# EAGLE design IgniterDriver (EAGLE 9.5.1)
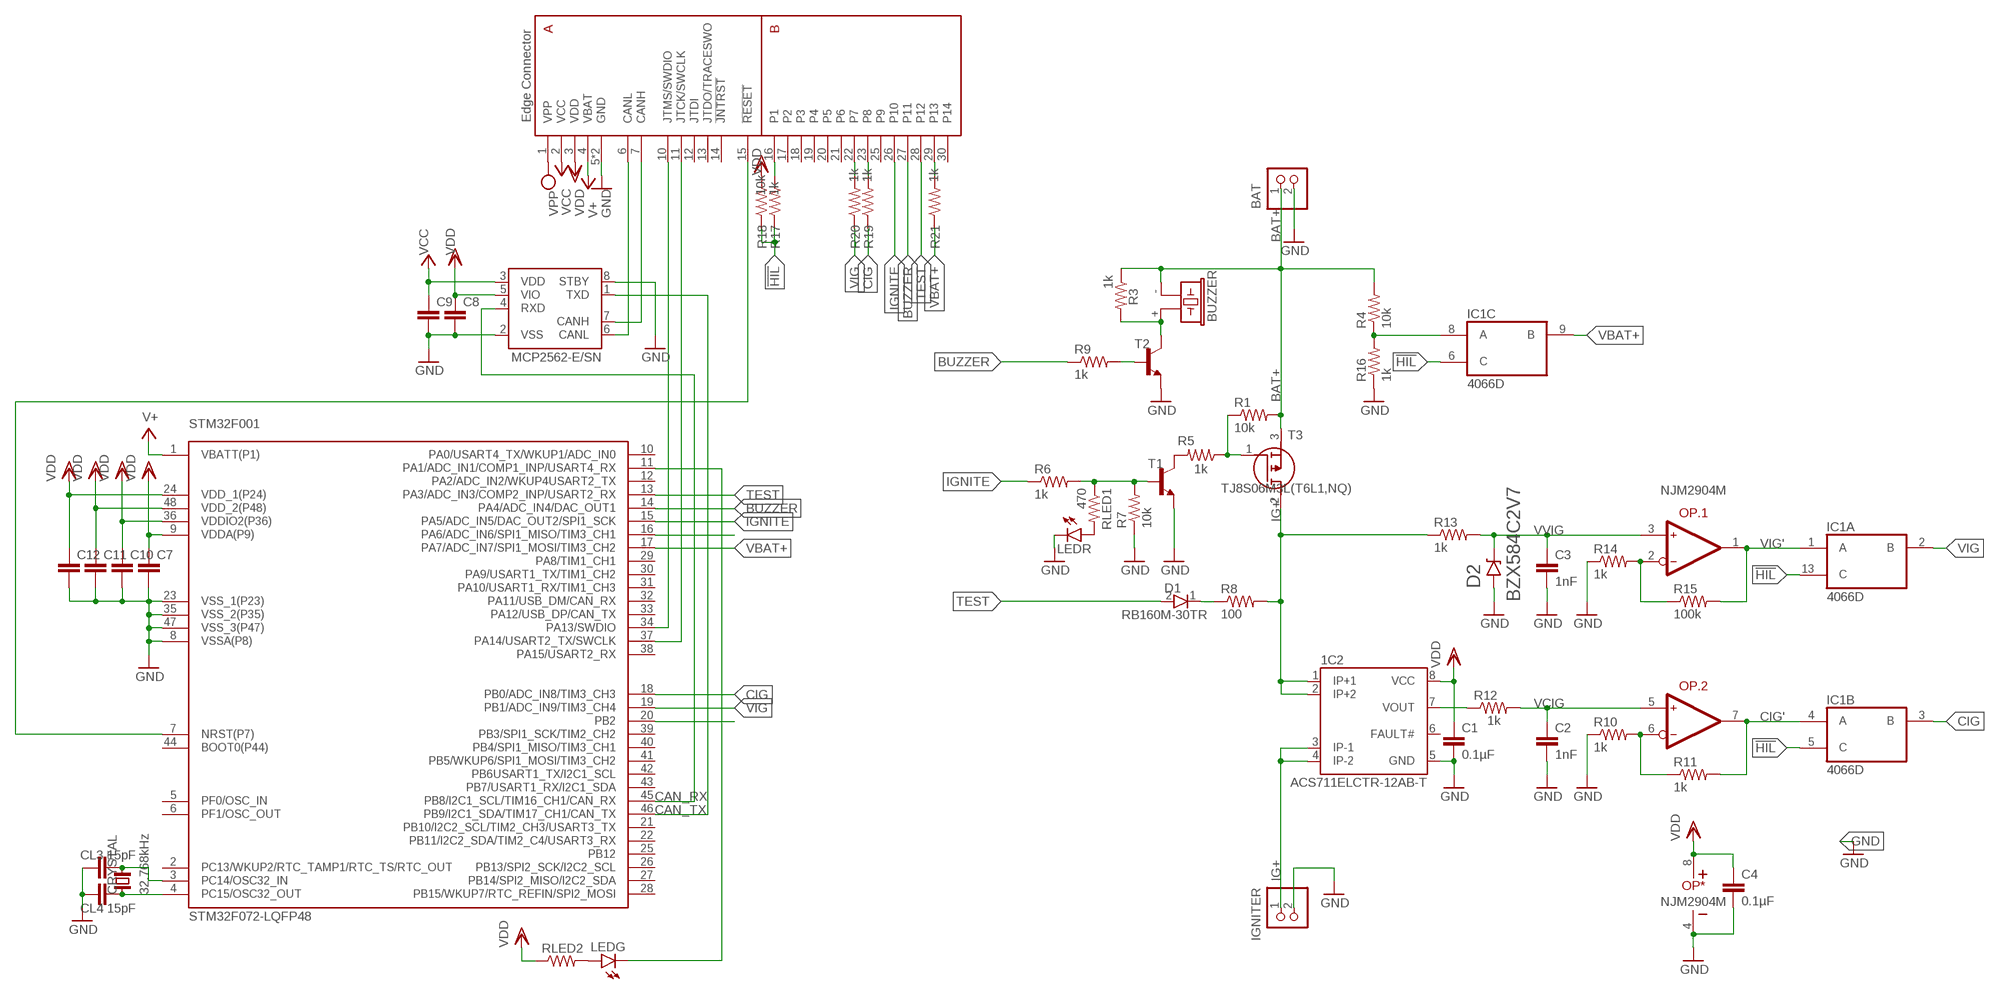
[diagram p0: schematic, sheet 1]

## Parts
1C2  ACS711ELCTR-12AB-T  [SOIC8]
BAT  S2B-XH-A  [S2B-XH-A]
BUZZER  F/CM12P  [F/CM12P]
C1  0.1µF  C-EUC0603K  [C0603K]
C2  1nF  C-EUC0603K  [C0603K]
C3  1nF  C-EUC0603K  [C0603K]
C4  0.1µF  C-EUC0603K  [C0603K]
C7  C-EUC0603K  [C0603K]
C8  C-EUC0603K  [C0603K]
C9  C-EUC0603K  [C0603K]
C10  C-EUC0603K  [C0603K]
C11  C-EUC0603K  [C0603K]
C12  C-EUC0603K  [C0603K]
CL3  15pF  C-EUC0603K  [C0603K]
CL4  15pF  C-EUC0603K  [C0603K]
CRYSTAL  32.768kHz  CRYTALFC-255  [FC-255]
D1  RB160M-30TR  [SODFL3516X90N]
D2  BZX584C2V7  BZX584C  [BZX584C]
IC1  4066D  [SO14]
IGNITER  S2B-XH-A  [S2B-XH-A]
LEDG  LEDCHIP-LED0603  [CHIP-LED0603]
LEDR  LEDCHIPLED_0603  [CHIPLED_0603]
MCP2562  MCP2562-E/SN  [SOIC127P600X175-8N]
OP  NJM2904M  [SO-8]
R1  10k  R-US_R0603  [R0603]
R3  1k  R-US_R0603  [R0603]
R4  10k  R-US_R0603  [R0603]
R5  1k  R-US_R0603  [R0603]
R6  1k  R-US_R0603  [R0603]
R7  10k  R-US_R0603  [R0603]
R8  100  R-US_R0603  [R0603]
R9  1k  R-US_R0603  [R0603]
R10  1k  R-US_R0603  [R0603]
R11  1k  R-US_R0603  [R0603]
R12  1k  R-US_R0603  [R0603]
R13  1k  R-US_R0603  [R0603]
R14  1k  R-US_R0603  [R0603]
R15  100k  R-US_R0603  [R0603]
R16  1k  R-US_R0603  [R0603]
R17  1k  R-US_R0603  [R0603]
R18  10k  R-US_R0603  [R0603]
R19  1k  R-US_R0603  [R0603]
R20  1k  R-US_R0603  [R0603]
R21  1k  R-US_R0603  [R0603]
RLED1  470  R-US_R0603  [R0603]
RLED2  R-US_R0603  [R0603]
STM32F001  STM32F072-LQFP48  [LQFP48]
T1  -NPN-SOT23-EBC  [SOT23-EBC]
T2  -NPN-SOT23-EBC  [SOT23-EBC]
T3  TJ8S06M3L(T6L1,NQ)  [TJ8S06M3LT6L1NQ]
U$2  EDGE30  [EDGE30]

## Nets
!HIL!: IC1.5(B:C) IC1.6(C:C) IC1.13(A:C) R17.1 R18.1
BAT+: BAT.1 BUZZER.- R1.2 R3.1 R4.2 T3.3(S)
BUZZER: R9.1 STM32F001.14(PA4/ADC_IN4/DAC_OUT1) U$2.27(P11)
CAN_RX: MCP2562.4(RXD) STM32F001.45(PB8/I2C1_SCL/TIM16_CH1/CAN_RX)
CAN_TX: MCP2562.1(TXD) STM32F001.46(PB9/I2C1_SDA/TIM17_CH1/CAN_TX)
CANH1: MCP2562.7(CANH) U$2.7(CANH)
CANL1: MCP2562.6(CANL) U$2.6(CANL)
CIG: IC1.3(B:B) R19.1 STM32F001.18(PB0/ADC_IN8/TIM3_CH3)
CIG': IC1.4(B:A) OP.7(.2:OUT) R11.2
GND: 1C2.5(GND) BAT.2 C1.2 C2.2 C3.2 C4.2 C7.2 C8.2 C9.2 C10.2 C11.2 C12.2 CL3.1 CL4.1 D2.A IGNITER.2 LEDR.C MCP2562.2(VSS) MCP2562.8(STBY) OP.4(*:V-) R7.1 R10.1 R14.1 R16.1 STM32F001.8(VSSA(P8)) STM32F001.23(VSS_1(P23)) STM32F001.35(VSS_2(P35)) STM32F001.47(VSS_3(P47)) T1.E T2.E U$2.5(GND) U$2.8(GND)
IG+: 1C2.3(IP-1) 1C2.4(IP-2) IGNITER.1
IG+': 1C2.1(IP+1) 1C2.2(IP+2) R8.2 R13.1 T3.2(D)
IGNITE: R6.1 STM32F001.15(PA5/ADC_IN5/DAC_OUT2/SPI1_SCK) U$2.26(P10)
N$1: R1.1 R5.1 T3.1(G)
N$2: R5.2 T1.C
N$6: R6.2 R7.2 RLED1.1 T1.B
N$7: D1.1(K) R8.1
N$8: BUZZER.+ R3.2 T2.C
N$11: OP.2(.1:IN-) R14.2 R15.1
N$12: OP.6(.2:IN-) R10.2 R11.1
N$13: LEDR.A RLED1.2
N$15: R9.2 T2.B
N$47: R21.2 U$2.29(P13)
N$52: R19.2 U$2.23(P8)
N$53: R20.2 U$2.22(P7)
N$64: STM32F001.16(PA6/ADC_IN6/SPI1_MISO/TIM3_CH1)
N$71: STM32F001.20(PB2)
N$78: CL4.2 CRYSTAL.1 STM32F001.4(PC15/OSC32_OUT)
N$79: CL3.2 CRYSTAL.2 STM32F001.3(PC14/OSC32_IN)
N$80: LEDG.C STM32F001.11(PA1/ADC_IN1/COMP1_INP/USART4_RX)
N$81: R17.2 U$2.16(P1)
N$83: LEDG.A RLED2.2
NRST1: STM32F001.7(NRST(P7)) U$2.15(!RESET!)
SWCLK1: STM32F001.37(PA14/USART2_TX/SWCLK) U$2.11(JTCK/SWCLK)
SWDIO1: STM32F001.34(PA13/SWDIO) U$2.10(JTMS/SWDIO)
TEST: D1.2(A) STM32F001.13(PA3/ADC_IN3/COMP2_INP/USART2_RX) U$2.28(P12)
VBAT+: IC1.9(C:B) R21.1 STM32F001.17(PA7/ADC_IN7/SPI1_MOSI/TIM3_CH2)
VBAT+': IC1.8(C:A) R4.1 R16.2
VBU: STM32F001.1(VBATT(P1)) U$2.4(VBAT) ; supply symbol labelled V+
VCC: C9.1 MCP2562.3(VDD) U$2.2(VCC)
VCIG: C2.1 OP.5(.2:IN+) R12.2
VDD: 1C2.8(VCC) C1.1 C4.1 C7.1 C8.1 C10.1 C11.1 C12.1 MCP2562.5(VIO) OP.8(*:V+) R18.2 RLED2.1 STM32F001.9(VDDA(P9)) STM32F001.24(VDD_1(P24)) STM32F001.36(VDDIO2(P36)) STM32F001.48(VDD_2(P48)) U$2.3(VDD)
VIG: IC1.2(A:B) R20.1 STM32F001.19(PB1/ADC_IN9/TIM3_CH4)
VIG': IC1.1(A:A) OP.1(.1:OUT) R15.2
VOUT: 1C2.7(VOUT) R12.1
VPP: U$2.1(VPP)
VVIG: C3.1 D2.C OP.3(.1:IN+) R13.2
Unconnected: 1C2.6(FAULT#) IC1.10(D:B) IC1.11(D:A) IC1.12(D:C) STM32F001.2(PC13/WKUP2/RTC_TAMP1/RTC_TS/RTC_OUT) STM32F001.5(PF0/OSC_IN) STM32F001.6(PF1/OSC_OUT) STM32F001.10(PA0/USART4_TX/WKUP1/ADC_IN0) STM32F001.12(PA2/ADC_IN2/WKUP4USART2_TX) STM32F001.21(PB10/I2C2_SCL/TIM2_CH3/USART3_TX) STM32F001.22(PB11/I2C2_SDA/TIM2_C4/USART3_RX) STM32F001.25(PB12) STM32F001.26(PB13/SPI2_SCK/I2C2_SCL) STM32F001.27(PB14/SPI2_MISO/I2C2_SDA) STM32F001.28(PB15/WKUP7/RTC_REFIN/SPI2_MOSI) STM32F001.29(PA8/TIM1_CH1) STM32F001.30(PA9/USART1_TX/TIM1_CH2) STM32F001.31(PA10/USART1_RX/TIM1_CH3) STM32F001.32(PA11/USB_DM/CAN_RX) STM32F001.33(PA12/USB_DP/CAN_TX) STM32F001.38(PA15/USART2_RX) STM32F001.39(PB3/SPI1_SCK/TIM2_CH2) STM32F001.40(PB4/SPI1_MISO/TIM3_CH1) STM32F001.41(PB5/WKUP6/SPI1_MOSI/TIM3_CH2) STM32F001.42(PB6USART1_TX/I2C1_SCL) STM32F001.43(PB7/USART1_RX/I2C1_SDA) STM32F001.44(BOOT0(P44)) U$2.12(JTDI) U$2.13(JTDO/TRACESWO) U$2.14(!JNTRST!) U$2.17(P2) U$2.18(P3) U$2.19(P4) U$2.20(P5) U$2.21(P6) U$2.25(P9) U$2.30(P14)

## Power pins joined to a net without a drawn wire
GND: IC1.7(P:VSS)
VDD: IC1.14(P:VDD)

## Library data of the parts
1C2 = allegro:ACS711E: SENSOR CURRENT 3.3V 8-SOIC tested: YES (etherbotix); CURRENT: 12.5A
BAT IGNITER = con-jst-xh:S2B-XH-A: Wire-to-Board 2.5mm pitch side mount connector Source: http://www.jst-mfg.com/product/pdf/jpn/XH.pdf http://www.jst-mfg.com/product/detail.php?series=277
BUZZER = buzzer:F/CM12P: BUZZER Source: Buerklin; OC_FARNELL: unknown; OC_NEWARK: unknown
C1-C4 C7-C12 CL3 CL4 = rcl:C-EU: CAPACITOR, European symbol; SPICEPREFIX: C
CRYSTAL = crystal':CRYTAL: CRYSTAL
D1 = RB160M-30TR:RB160M-30TR: ROHM - RB160M-30TR - DIODE, SCHOTTKY, PMDS Source: Datasheet <https://componentsearchengine.com/Datasheets/2/RB160M-30TR.pdf>; DESCRIPTION: ROHM - RB160M-30TR - DIODE, SCHOTTKY, PMDS; HEIGHT: 0.9mm; MANUFACTURER_NAME: ROHM Semiconductor; MANUFACTURER_PART_NUMBER: RB160M-30TR; MOUSER_PART_NUMBER: 755-RB160M-30TR; MOUSER_PRICE-STOCK: https://www.mouser.com/Search/Refine.aspx?Keyword=755-RB160M-30TR; RS_PART_NUMBER: 7526079; RS_PRICE-STOCK: https://uk.rs-online.com/web/p/products/7526079
D2 = diodes:BZX584C
IC1 = 40xx:4066: Quad bilateral ANALOG SWITCH
LEDG LEDR = led:LED: LED OSRAM: - CHIPLED LG R971, LG N971, LY N971, LG Q971, LY Q971, LO R971, LY R971 LH N974, LH R974 LS Q976, LO Q976, LY Q976 LO Q996 - Hyper CHIPLED LW Q18S LB Q993, LB Q99A, LB R99A - SideLED LS A670, LO A670, LY A670, LG A670, LP A670 LB A673, LV A673, LT A673, LW A673 LH A674 LY A675 LS A676, LA A676, LO A676, LY A676, LW A676 LS A679, LY A679, LG A679 - Hyper Micro SIDELED® LS Y876, LA Y876, LO Y876, LY Y876 LT Y87S - SmartLED LW L88C, LW L88S LB L89C, LB L89S, LG L890 LS L89K, LO L89K, LY L89K LS L896, LA L896, LO L896, LY L896 - TOPLED LS T670, LO T670, LY T670, LG T670, LP T670 LSG T670, LSP T670, LSY T670, LOP T670, LYG T670 LG T671, LOG T671, LSG T671 LB T673, LV T673, LT T673, LW T673 LH T674 LS T676, LA T676, LO T676, LY T676, LB T676, LH T676, LSB T676, LW T676 LB T67C, LV T67C, LT T67C, LS T67K, LO T67K, LY T67K, LW E67C LS E67B, LA E67B, LO E67B, LY E67B, LB E67C, LV E67C, LT E67C LW T67C LS T679, LY T679, LG T679 LS T770, LO T770, LY T770, LG T770, LP T770 LB T773, LV T773, LT T773, LW T773 LH T774 LS E675, LA E675, LY E675, LS T675 LS T776, LA T776, LO T776, LY T776, LB T776 LHGB T686 LT T68C, LB T68C - Hyper Mini TOPLED® LB M676 - Mini TOPLED Santana® LG M470 LS M47K, LO M47K, LY M47K Source: http://www.osram.convergy.de LUXEON: - LUMILED® LXK2-PW12-R00, LXK2-PW12-S00, LXK2-PW14-U00, LXK2-PW14-V00 LXK2-PM12-R00, LXK2-PM12-S00, LXK2-PM14-U00 LXK2-PE12-Q00, LXK2-PE12-R00, LXK2-PE12-S00, LXK2-PE14-T00, LXK2-PE14-U00 LXK2-PB12-K00, LXK2-PB12-L00, LXK2-PB12-M00, LXK2-PB14-N00, LXK2-PB14-P00, LXK2-PB14-Q00 LXK2-PR12-L00, LXK2-PR12-M00, LXK2-PR14-Q00, LXK2-PR14-R00 LXK2-PD12-Q00, LXK2-PD12-R00, LXK2-PD12-S00 LXK2-PH12-R00, LXK2-PH12-S00 LXK2-PL12-P00, LXK2-PL12-Q00, LXK2-PL12-R00 Source: www.luxeon.com KINGBRIGHT: KA-3528ASYC Source: www.kingbright.com
MCP2562 = mcp2562-E_SN:MCP2562-E/SN: MCP2562 Series 5 V Surface Mount High-Speed CAN Transceiver - SOIC-8; AVAILABILITY: Unavailable; DESCRIPTION: Microchip MCP2562-E/SN, CAN Transceiver 1MBps 1-channel IEC 61000-4-2, 8-Pin SOIC; MF: Microchip; MP: MCP2562-E/SN; PACKAGE: SO-8 Microchip; PRICE: None
OP = ic-jrc:NJM2904; MOUSER: 513-NJM2904M
R1 R3-R18 RLED1 RLED2 = rcl:R-US_: RESISTOR, American symbol; SPICEPREFIX: R
R19-R21 = resistor:R-US_: RESISTOR, American symbol
STM32F001 = stm32f0:STM32F072
T1 T2 = transistor:*-NPN-: NPN Transistror BF959 corrected 2008.03.06
T3 = TJ8S06M3L(T6L1_NQ):TJ8S06M3L(T6L1,NQ): MOSFET P-Ch MOS -8A -60V 27W 890pF 0.104 Source: Datasheet <http://toshiba.semicon-storage.com/info/docget.jsp?did=22588&prodName=TJ8S06M3L>; DESCRIPTION: MOSFET P-Ch MOS -8A -60V 27W 890pF 0.104; HEIGHT: 2mm; MANUFACTURER_NAME: Toshiba; MANUFACTURER_PART_NUMBER: TJ8S06M3L(T6L1,NQ); MOUSER_PART_NUMBER: 757-TJ8S06M3LT6L1NQ; MOUSER_PRICE-STOCK: https://www.mouser.com/Search/Refine.aspx?Keyword=757-TJ8S06M3LT6L1NQ
U$2 = bus:EDGE30

## Board
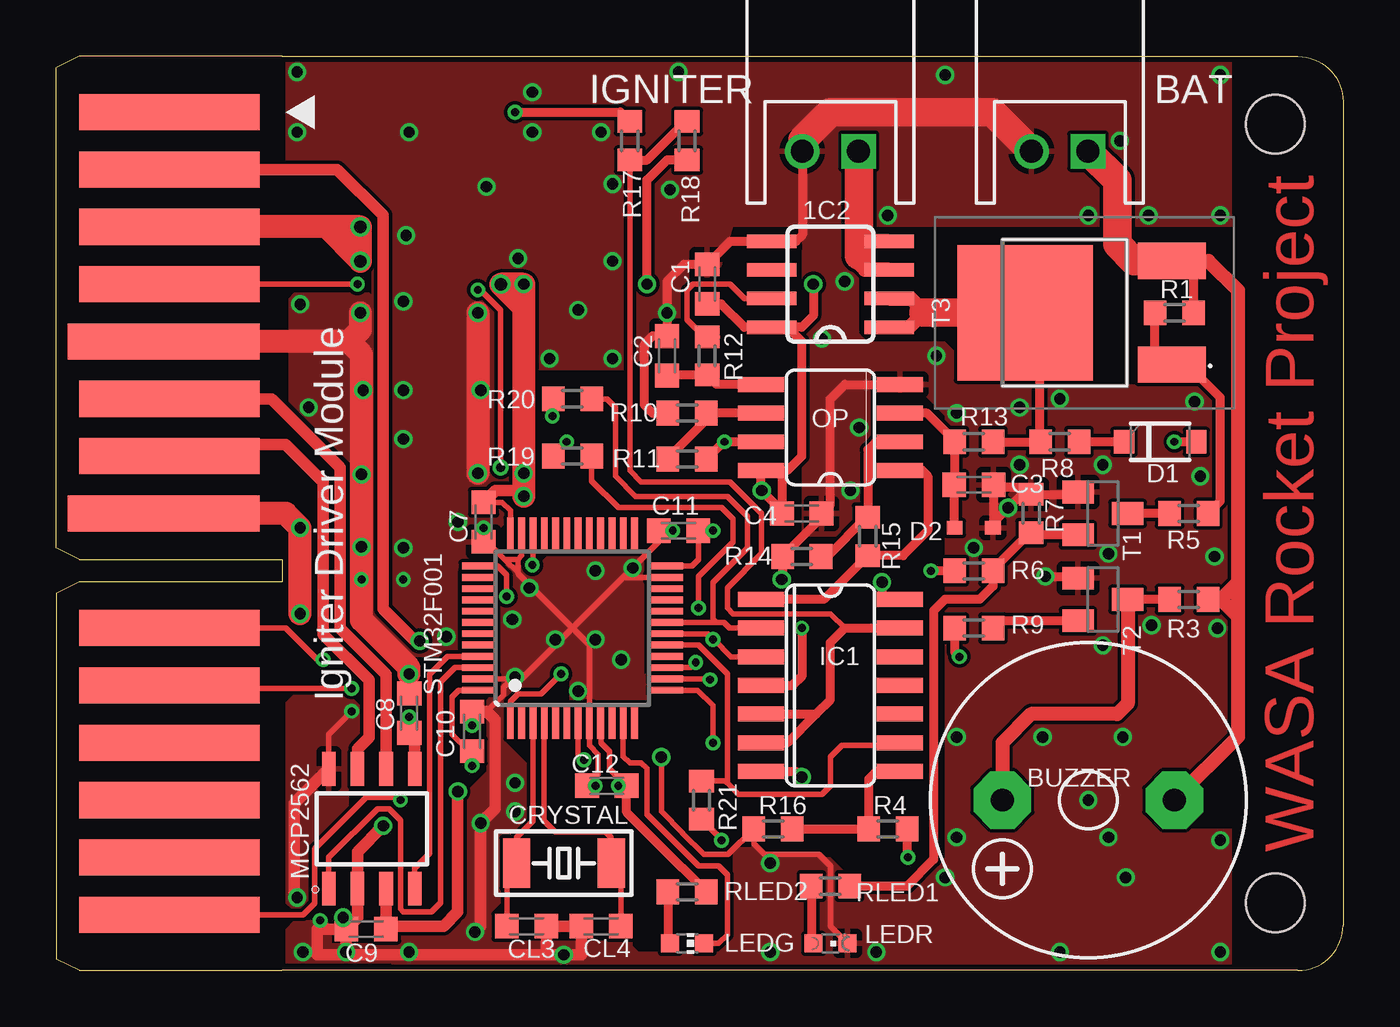
[diagram p1: board, top side]
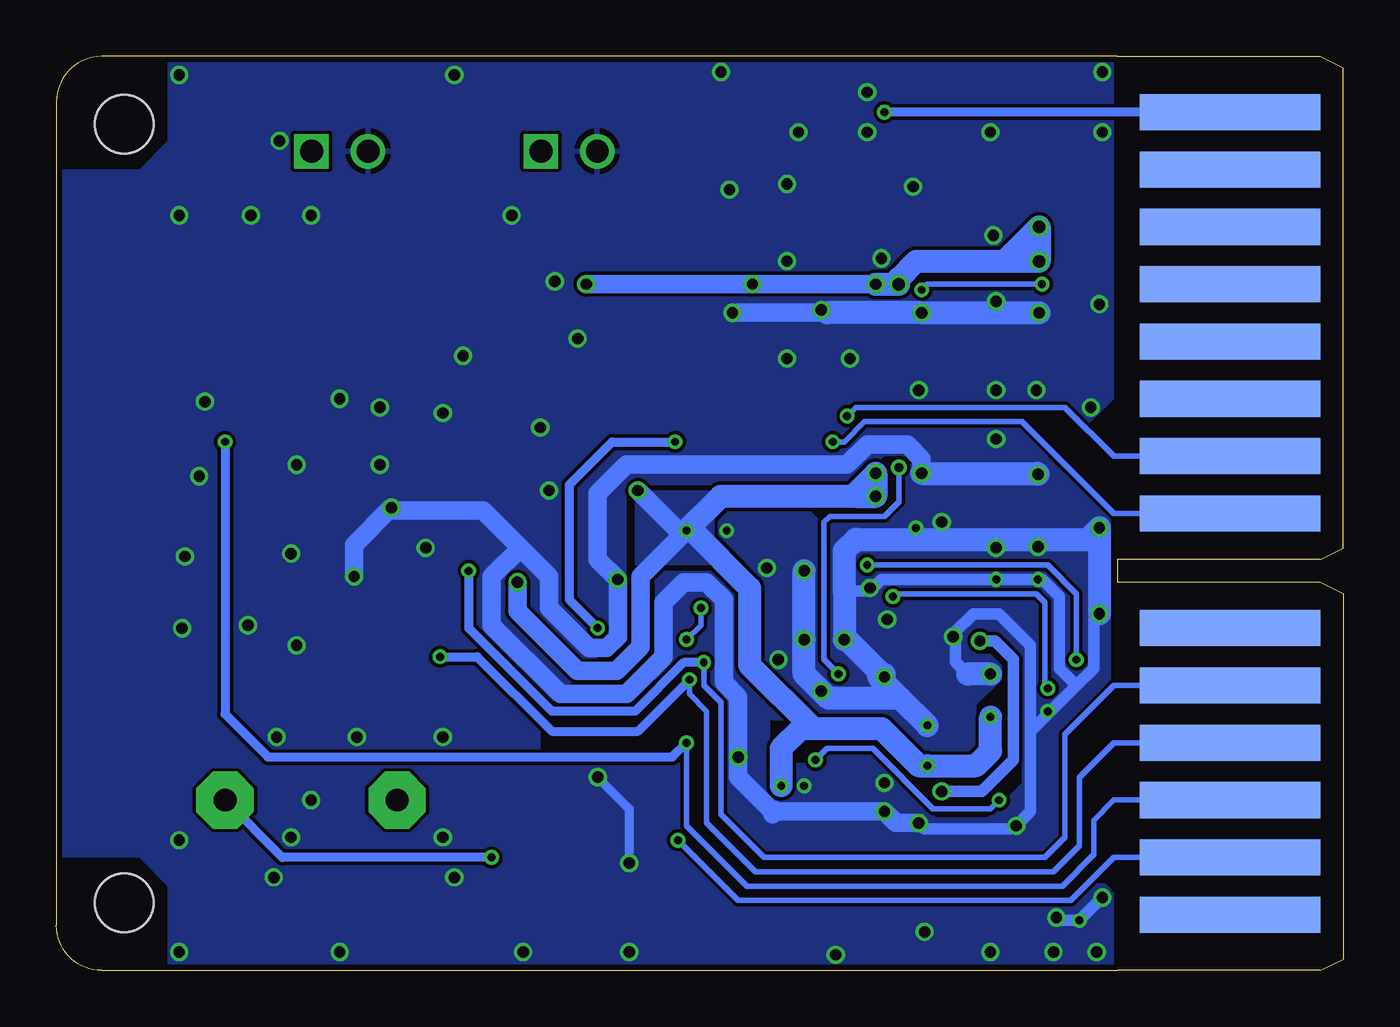
[diagram p2: board, bottom side, seen from below]

Size 57 x 40.5 mm. Coordinates in mm from the lower left corner, seen from the top.
Outline: 10,40.5 55,40.5 arc-90 57,38.5 57,2 arc-90 55,0 10,0
Copper layers (1*16): Top 0.035mm / dielectric 1.5mm / Bottom 0.035mm
Design rules "SeeedStudio_2layer_DRU_no_angle_20140221": minimum track width 6mil, minimum drill 12mil, track to track 6mil, track to pad 6mil, pad to pad 6mil, via to via 6mil, smd to smd 0mil, copper to edge 10mil, drill to drill 10mil, minimum pad ring 10mil, minimum via ring 6mil, stop-mask expansion 2mil, vias tented up to drill 100mil, thermal gap 10mil
Holes 2.6 mm at 54,3 54,37.5

### Footprints (pad centres in the part's own frame; a part is rotated, then mirrored left to right if it is on the bottom)
SOIC8 = smd 0.6 x 2.2: 1 -1.905,-2.6; 2 -0.635,-2.6; 3 0.635,-2.6; 4 1.905,-2.6; 5 1.905,2.6; 6 0.635,2.6; 7 -0.635,2.6; 8 -1.905,2.6
S2B-XH-A = drill 1.016 square: 1 1.25,0 | drill 1.016: 2 -1.25,0
F/CM12P = drill 1.016 pad 2.54 octagon: + 3.81,0; - -3.81,0
C0603K = smd 1.05 x 1.08: 1 -0.875,0; 2 0.875,0
FC-255 = smd 1.2 x 2.2: 1 -2.1,0; 2 2.1,0
SODFL3516X90N = smd 0.9 x 1.04: 1 -1.6,0; 2 1.6,0
BZX584C = smd 0.7 x 0.6: A -0.85,0; C 0.85,0
SO14 = smd 0.66 x 2.032: 1 -3.81,-3.073; 2 -2.54,-3.073; 3 -1.27,-3.073; 4 0,-3.073; 5 1.27,-3.073; 6 2.54,-3.073; 7 3.81,-3.073; 8 3.81,3.073; 9 2.54,3.073; 10 1.27,3.073; 11 0,3.073; 12 -1.27,3.073; 13 -2.54,3.073; 14 -3.81,3.073
CHIP-LED0603 = smd 0.8 x 0.8: A 0,-0.75; C 0,0.75
CHIPLED_0603 = smd 0.8 x 0.8: A 0,-0.75; C 0,0.75
SOIC127P600X175-8N = smd 1.5 x 0.6: 1 -2.65,1.905; 2 -2.65,0.635; 3 -2.65,-0.635; 4 -2.65,-1.905; 5 2.65,-1.905; 6 2.65,-0.635; 7 2.65,0.635; 8 2.65,1.905
SO-8 = smd 0.66 x 2.032: 1 -1.905,-3.073; 2 -0.635,-3.073; 3 0.635,-3.073; 4 1.905,-3.073; 5 1.905,3.073; 6 0.635,3.073; 7 -0.635,3.073; 8 -1.905,3.073
R0603 = smd 1 x 1.1: 1 -0.85,0; 2 0.85,0
LQFP48 = smd 1.5 x 0.3: 1 -4.15,2.75; 2 -4.15,2.25; 3 -4.15,1.75; 4 -4.15,1.25; 5 -4.15,0.75; 6 -4.15,0.25; 7 -4.15,-0.25; 8 -4.15,-0.75; 9 -4.15,-1.25; 10 -4.15,-1.75; 11 -4.15,-2.25; 12 -4.15,-2.75; 25 4.15,-2.75; 26 4.15,-2.25; 27 4.15,-1.75; 28 4.15,-1.25; 29 4.15,-0.75; 30 4.15,-0.25; 31 4.15,0.25; 32 4.15,0.75; 33 4.15,1.25; 34 4.15,1.75; 35 4.15,2.25; 36 4.15,2.75 | smd 0.3 x 1.5: 13 -2.75,-4.15; 14 -2.25,-4.15; 15 -1.75,-4.15; 16 -1.25,-4.15; 17 -0.75,-4.15; 18 -0.25,-4.15; 19 0.25,-4.15; 20 0.75,-4.15; 21 1.25,-4.15; 22 1.75,-4.15; 23 2.25,-4.15; 24 2.75,-4.15; 37 2.75,4.15; 38 2.25,4.15; 39 1.75,4.15; 40 1.25,4.15; 41 0.75,4.15; 42 0.25,4.15; 43 -0.25,4.15; 44 -0.75,4.15; 45 -1.25,4.15; 46 -1.75,4.15; 47 -2.25,4.15; 48 -2.75,4.15
SOT23-EBC = smd 1 x 1.4: B 0.95,-1.1; C 0,1.1; E -0.95,-1.1
TJ8S06M3LT6L1NQ = smd 1.6 x 3: 1 -2.3,-7.5; 3 2.3,-7.5 | smd 6 x 6: 2 0,-1
EDGE30 = smd 1.6 x 8: 1 -17.78,-5; 2 -15.24,-5; 3 -12.7,-5; 4 -10.16,-5; 6 -5.08,-5; 7 -2.54,-5; 10 5.08,-5; 11 7.62,-5; 12 10.16,-5; 13 12.7,-5; 14 15.24,-5; 15 17.78,-5 | smd 1.6 x 8.5: 5 -7.62,-5.25; 8 0,-5.25 | smd 1.6 x 8 bottom: 16 -17.78,-5; 17 -15.24,-5; 18 -12.7,-5; 19 -10.16,-5; 20 -7.62,-5; 21 -5.08,-5; 22 -2.54,-5; 23 0,-5; 25 5.08,-5; 26 7.62,-5; 27 10.16,-5; 28 12.7,-5; 29 15.24,-5; 30 17.78,-5

### Placement (x,y rotation side)
1C2  34.29,30.41 90 top
BAT  44.45,36.3 0 top
BUZZER  45.72,7.55 180 top
C1  28.83,30.41 90 top
C2  27.05,27.23 90 top
C3  40.64,21.52 0 top
C4  33.02,20.25 0 top
C7  18.92,19.87 270 top
C8  15.63,11.41 90 top
C9  13.72,1.84 180 top
C10  18.41,10.6 90 top
C11  27.56,19.49 180 top
C12  24.38,8.19 180 top
CL3  20.83,1.96 180 top
CL4  24.13,1.96 0 top
CRYSTAL  22.48,4.76 180 top
D1  48.9,23.43 0 top
D2  40.64,19.61 180 top
IC1  34.29,12.63 270 top
IGNITER  34.29,36.3 0 top
LEDG  27.94,1.2 270 top
LEDR  34.29,1.2 270 top
MCP2562  13.97,6.28 90 top
OP  34.29,24.06 90 top
R1  49.53,29.14 0 top
R3  50.16,16.44 180 top
R4  36.83,6.28 0 top
R5  50.16,20.25 180 top
R6  40.64,17.71 0 top
R7  43.18,20.25 270 top
R8  44.45,23.43 180 top
R9  40.64,15.17 0 top
R10  27.94,24.7 0 top
R11  27.94,22.66 0 top
R12  28.83,27.23 270 top
R13  40.64,23.43 180 top
R14  33.02,18.34 0 top
R15  35.94,19.23 270 top
R16  31.75,6.28 0 top
R17  25.4,36.76 90 top
R18  27.94,36.76 270 top
R19  22.86,22.79 180 top
R20  22.86,25.33 180 top
R21  28.57,7.55 270 top
RLED1  34.29,3.74 180 top
RLED2  27.94,3.49 180 top
STM32F001  22.86,15.17 90 top
T1  46.35,20.25 270 top
T2  46.35,16.44 270 top
T3  41.91,29.14 90 top
U$2  10,20.25 270 top

### Tracks (layer width: path | path; a pad name or v marks a point on that pad's centre or on a via)
!HIL!
  Top 0.254: 34.92,15.17 34.29,15.8 29.97,15.8 29.72,16.06 29.72,16.95 31.24,18.47 31.24,20.25 29.84,21.65 25.91,21.65 25.4,22.16 R17.1
  Top 0.406: IC1.6 32.38,10.09 33.66,11.36 | IC1.13 34.92,15.17 34.29,14.54 34.29,11.99 33.66,11.36 | IC1.5 33.66,11.36 | R17.1 26.16,35.91 27.86,37.61 R18.1
BAT+  (via drill 0.35)
  Top 0.406: T3.3 50.11,31.44 | R4.2 37.68,5.05 v37.72,5.01 | R1.2 50.38,31.02 50.8,31.44
  Top 0.61: T3.3 50.8,31.44 51.04,31.44 52.34,30.14 52.34,17.2 | BUZZER.- 52.34,10.36 52.34,15.68 | 52.34,17.2 52.34,15.68 | R3.1 51.58,16.44 | 51.58,16.44 52.34,17.2 | 51.58,16.44 52.34,15.68
  Top 1.27: BAT.1 46.99,35.01 46.99,32.19 47.74,31.44 T3.3
  Bottom 0.406: v37.72,5.01 46.99,5.01 BUZZER.-
BUZZER  (via drill 0.35)
  Top 0.254: STM32F001.14 28.92,12.92 v28.96,12.88
  Top 0.406: R9.1 39.79,14.12 v40.01,13.9
  Bottom 0.254: U$2.27 10.16,10.09 11.68,8.57 11.68,5.52 12.83,4.38 26.04,4.38 28.19,6.53 28.19,11.49 28.96,12.25 v28.96,12.88
  Bottom 0.406: v40.01,13.9 38.35,13.9 35.05,10.6 31.24,10.6 v28.96,12.88
CAN_RX
  Top 0.254: STM32F001.45 17.33,13.92 16.54,13.13 16.54,5.18 15.88,4.52 MCP2562.4
CAN_TX
  Top 0.254: STM32F001.46 17.66,13.42 17.02,12.78 17.02,3 16.61,2.6 15.37,2.6 15.24,2.72 15.24,6.66 14.73,7.17 14.22,7.17 12.06,5.01 MCP2562.1
CANH1
  Top 0.508: MCP2562.7 13.34,9.82 13.84,10.33 13.84,12.87 11.81,14.9 11.81,21.65 10.16,23.3 5.51,23.3 U$2.7
CANL1
  Top 0.508: MCP2562.6 14.61,13.12 12.57,15.15 12.57,22.28 9.53,25.33 U$2.6
CIG  (via drill 0.35)
  Top 0.254: IC1.3 29.89,13.9 29.12,14.66 v29.08,14.66 29.08,14.7 28.86,14.92 STM32F001.18 | v28.45,16.06 28.45,17.46 29.97,18.98 29.97,20 29.46,20.5 24.89,20.5 23.71,21.69 R19.1
  Bottom 0.254: v29.08,14.66 28.45,15.3 v28.45,16.06
CIG'  (via drill 0.35)
  Top 0.406: OP.7 v29.59,23.43 29.55,23.43 R11.2 | v33.02,15.17 33.02,13.04 32.61,12.63 IC1.4
  Bottom 0.406: v29.59,23.43 32.38,23.43 34.29,21.52 34.29,16.44 v33.02,15.17
GND  (via drill 0.35, 0.5)
  Top 0.254: STM32F001.35 20.61,18.38 20.45,18.22 | 20.45,17.63 20.45,18.22 | STM32F001.47 20.19,12.92 | 20.19,12.92 20.61,12.92 22.86,15.17 | 22.86,15.17 20.45,17.58 20.45,17.63 | 22.86,15.17 23.61,14.42 STM32F001.8 23.61,9.97 24,9.58 24,8.68 C12.2 | STM32F001.23 25.11,17.42 | 22.86,15.17 25.11,17.42 | 19.16,11.47 19.06,11.47 19.81,12.22 19.81,12.54 20.19,12.92 | C7.2 19.18,18.74 19.34,18.74 19.86,18.22 | 20.45,18.22 19.86,18.22 | 19.86,18.22 20.45,17.63 | 25.11,17.42 v25.53,17.84 26.68,18.99 C11.2 | MCP2562.8 12.06,10.47 v13.08,11.49 | LEDR.C 34.29,1.95 34.29,4.63 33.78,5.14 31.37,5.14 30.9,5.61 R16.1 29.76,5.14 28.69,5.14 27.75,6.08 27.75,6.09 26.8,7.04 v26.8,9.46
  Top 0.406: R7.1 45.16,21.1 T1.E | R7.1 42.89,21.39 41.64,21.39 C3.2 41.52,19.64 D2.A 41.49,19.83 v42.16,20.5 42.76,21.1 R7.1 | OP.4 34.92,25.96 34.29,25.33 34.29,20.64 C4.2 33.9,20.07 R14.1 32.17,17.37 v32.13,17.33 | R10.1 26.42,24.7 26.04,25.08 26.04,27.73 26.42,28.11 C2.2 v27.05,29.14 27.05,30.54 27.8,31.29 C1.2 29.86,32.31 1C2.5 32.77,32.31 33.04,32.59 IGNITER.2 | v43.81,17.46 45.19,17.46 T2.E | IC1.7 32.77,8.82 v33.02,8.57
  Top 0.508: C9.2 13.34,2.33 MCP2562.2 13.34,5.26 v14.48,6.41 | 12.84,0.95 13.1,0.69 v22.48,0.69 | C9.2 12.84,0.95 | v18.54,1.71 18.8,1.96 v18.8,6.53 19.43,7.17 19.43,11.11 19.06,11.47 C10.2 v18.41,10.85 | v15.62,13.14 v15.63,13.13 C8.2 | v18.92,19.61 C7.2 | v27.3,19.49 C11.2 | v22.48,0.69 23.25,0.69 CL4.1 CL3.1 21.7,0.69 v22.48,0.69 | C9.2 11.56,1.84 11.56,0.69 12.59,0.69 12.84,0.95 | MCP2562.8 10.54,7.41 10.54,3.36 v10.67,3.23
  Top 1.016: U$2.8 10.16,20.25 v10.79,19.61 v10.79,15.8 | 12.95,27.87 U$2.5 | v15.62,13.14 15.62,13.42 13.51,15.53 v13.51,17.32 v13.51,18.77 v13.51,21.98 13.51,27.31 12.95,27.87 | v18.67,29.14 v18.67,22.03 | v13.46,29.14 13.46,28.38 12.95,27.87
  Top 1.27: BAT.2 41.47,38.03 34.29,38.03 33.04,36.78 IGNITER.2
  Bottom 0.406: v33.02,8.57 31.62,7.17 v31.62,4.76
  Bottom 0.508: 16.64,13.14 17.17,13.67 17.17,15.02 16.38,15.8 15.24,15.8 13.84,14.41 13.84,10.6 | 13.84,10.6 13.84,7.04 v14.48,6.41 14.61,6.28 18.54,6.28 v18.8,6.53 | 13.84,10.6 11.81,12.63 | 11.81,12.63 11.05,13.39 11.05,15.55 v10.79,15.8 | 11.05,19.36 v10.79,19.61 | 22.1,16.82 20.95,16.82 20.46,17.32 v13.51,17.32 13.33,17.32 12.57,16.57 12.57,13.39 11.81,12.63 | v12.7,2.34 12.57,2.22 v11.68,2.22 v10.67,3.23
  Bottom 0.813: v18.67,22.03 18.67,22.66 19.3,23.3 21.08,23.3 21.97,22.41 31.75,22.41 33.02,21.14 33.02,18.22 v32.13,17.33 32.13,14.79 32.64,14.28 33.4,14.28 35.18,16.06 35.18,17.46 36.45,18.73 | 36.45,18.73 38.1,20.38 42.04,20.38 v42.16,20.5 43.81,18.85 v43.81,17.46 | 22.86,29.14 v27.05,29.14 | v18.8,6.53 19.81,6.53 v20.32,7.04 25.15,7.04 | 25.27,6.91 25.15,7.04 | 36.45,18.73 37.72,17.46 37.72,15.3 34.67,12.25 31.75,12.25 30.1,13.9 30.1,16.31 29.21,17.2 28.19,17.2 27.43,16.44 27.43,12.76 26.8,12.12 v26.8,9.46 26.8,8.58 25.33,7.12 25.22,7.12 25.15,7.04
  Bottom 1.016: v15.62,13.14 16.64,13.14 | 19.62,12.06 20.57,13.01 20.57,13.14 20.32,13.14 v20.32,13.01 21.97,14.66 v22.1,14.66 22.1,16.82 22.1,18.6 21.59,19.11 11.3,19.11 v10.79,19.61 v10.79,15.8 | 19.62,12.06 v18.41,10.85 | 19.62,12.06 22.8,12.06 v23.11,12.38 23.88,13.14 v23.88,14.66 v23.88,17.71 | v13.51,21.98 13.56,22.03 v18.67,22.03 | v13.46,29.14 v18.67,29.14 22.86,29.14
  other vias: 23.88,8.19 20.32,8.31 10.92,0.82 12.83,0.82 20.95,16.95 20.19,15.55 25.02,13.77 15.62,0.82 17.27,14.79 51.56,0.82 44.45,0.82 36.32,0.82 31.62,0.82 39.37,4.12 47.37,4.12 51.56,5.77 46.61,5.9 45.72,7.55 47.24,10.34 43.69,10.34 39.88,10.34 39.88,5.9 51.44,15.17 51.31,18.34 48.51,15.3 46.35,14.41 50.67,21.9 50.42,25.2 46.35,22.41 46.61,18.47 40.64,18.73 42.67,22.41 42.67,24.95 44.45,25.33 39.88,24.7 38.99,27.23 35.56,24.06 35.18,21.27 51.56,33.46 48.39,33.46 45.72,33.46 47.12,36.76 51.56,39.68 39.37,39.68 36.83,33.46 34.92,30.54 33.91,28 27.56,39.81 27.18,34.6 24.64,34.86 24.64,31.43 24.64,27.11 21.84,27.11 23.11,29.27 20.45,31.55 24.13,37.14 21.08,38.92 21.08,37.14 19.05,34.73 15.62,37.14 10.67,39.81 10.67,37.14 15.49,32.57 10.79,29.52 15.37,29.65 18.8,25.71 15.37,25.71 13.59,25.71 11.18,24.95 15.37,23.55 15.37,18.73 17.78,19.87 15.37,17.33
  pour Top: 19.68,17.96 19.68,13.14 26.04,13.14 26.04,17.96
  pour Top: 19.68,13.14 19.68,12.12 20.32,12.12 20.32,12.38 21.97,12.38 21.97,13.14
  pour Top: 26.16,13.14 22.73,13.14 22.73,11.99 26.16,11.99
  pour Bottom: 23.24,17.33 23.24,20 24.26,21.01 27.69,21.01 27.69,12.12 26.67,11.11 20.32,11.11 18.92,9.71 16.51,9.71 16.26,9.96 16.26,20.25 22.23,20.25 22.73,19.74 22.73,13.9
  pour Bottom: 16.26,14.03 15.62,14.03 15.11,13.52 15.11,12.88 16.26,11.74
  pour Bottom: 20.76,20.82 17.65,23.93 14.22,23.93 10.29,20 10.29,11.99 11.68,10.6 14.48,10.6 14.61,10.72 14.61,14.03 15.11,14.54 16.26,14.54 16.26,16.31
  pour Bottom: 11.94,4.63 26.8,4.63 26.8,5.64 22.86,9.58 20.83,9.58 18.03,6.79 15.75,6.79 14.22,8.31 14.22,11.23 11.94,11.23
  pour Top (no thermals): 25.53,1.33 25.53,-0.07 14.86,-0.07 14.86,2.09 19.43,2.09 19.43,1.33
  pour Top (no thermals): 19.94,12.12 19.81,11.99 19.81,10.22 20.95,9.07 20.95,6.79 19.68,5.52 19.68,2.98 19.3,2.6 19.3,2.09 17.91,2.09 17.91,2.22 18.03,2.34 18.03,7.8 19.05,8.82 19.05,11.99 19.18,12.12
  pour Top (no thermals): 14.99,0.31 10.16,0.31 10.16,1.84 10.54,2.22 11.94,2.22 12.19,1.96 12.19,1.2 14.99,1.2
  pour Top (no thermals): 21.21,17.58 21.21,17.84 21.72,18.34 26.04,18.34 26.04,17.71 21.34,17.71
  pour Top (no thermals): 13.84,15.8 13.84,15.93 13.84,25.2
  pour Bottom: 10.16,-0.07 10.16,3.49 25.53,3.49 25.53,-0.07
  pour Bottom: 13.84,0.31 10.41,0.31 10.41,1.07 10.67,1.33 13.84,1.33
  pour Bottom: 11.68,1.84 13.08,1.84 13.34,2.09 13.34,2.22 13.34,2.6 13.08,2.85 12.7,2.85 11.94,2.85 10.92,3.87 10.54,3.87 10.29,3.61 10.29,2.85 11.18,1.96 11.3,1.84
  pour Top: 10.41,2.72 10.79,2.72 11.18,3.11 11.18,5.52 12.95,7.3 12.95,9.96 13.59,10.6 13.59,11.61 12.95,12.25 10.54,12.25 10.16,11.87 10.16,2.98
  pour Top: 13.08,15.55 13.08,22.41 10.29,25.2 10.29,29.77 10.54,30.03 13.84,30.03 14.1,29.77 14.1,15.17 13.46,15.17
  pour Bottom (rank 2): 10.16,22.79 20.32,22.79 21.59,21.52 31.75,21.52 57.15,21.52 57.15,35.49 53.34,35.49 52.07,36.76 52.07,40.57 10.16,40.57 10.16,25.33 11.43,24.06
  pour Bottom (rank 2): 57.15,25.33 31.75,25.33 31.75,15.17 35.56,11.36 35.56,-0.07 52.07,-0.07 52.07,3.74 53.34,5.01 57.15,5.01
  pour Bottom (rank 2): 30.48,-0.07 25.4,-0.07 25.4,17.71 30.48,17.71
  pour Bottom (rank 2): 21.59,-0.07 35.56,-0.07 35.56,9.2 21.59,9.2
  pour Top (rank 2): 10.16,40.57 52.07,40.57 52.07,32.95 35.56,32.95 10.16,32.95
  pour Top (rank 2): 13.97,32.95 13.97,15.17 15.24,13.9 17.78,13.9 17.78,17.71 20.32,20.25 20.32,26.6 25.4,26.6 29.21,30.41 29.97,32.95
  pour Top (rank 2): 33.02,18.98 33.27,19.23 36.07,19.23 36.07,27.74 35.56,28.25 35.56,29.01 35.56,32.95 33.02,32.95
  pour Top (rank 2): 25.4,-0.07 52.07,-0.07 52.07,6.28 49.53,6.28 48.26,7.55 49.53,8.82 50.8,8.82 52.07,10.09 52.07,25.96 41.27,25.96 39.37,27.87 35.56,27.87 35.56,26.35 36.2,25.71 36.32,25.58 38.35,25.58 39.37,24.57 39.37,24.06 39.37,5.01 38.1,3.74 35.56,3.74 34.29,5.01 31.5,5.01 30.99,5.52 29.97,5.52 29.97,1.45 29.34,0.82 25.78,0.82 25.4,1.2
IG+
  Top 0.61: 1C2.3 35.81,31.05 35.37,31.49 35.56,31.68 | 1C2.4 36.07,32.31 35.56,31.81
  Top 1.27: IGNITER.1 35.56,36.28 35.56,31.81 35.56,31.68
IG+'
  Top 0.406: R13.1 R8.2 43.55,23.48 43.55,28.51 T3.2
  Top 0.61: 1C2.2 37.85,29.77 38.48,29.14 | 38.41,29.14 37.78,28.51 1C2.1
  Top 1.27: 38.41,29.14 38.48,29.14 T3.2
IGNITE  (via drill 0.35)
  Top 0.254: STM32F001.15 28.09,13.42 v28.32,13.65
  Top 0.406: R6.1 v38.73,17.71
  Bottom 0.254: U$2.26 10.16,12.63 12.32,10.47 12.32,5.9 13.21,5.01 25.65,5.01 27.56,6.91 27.56,11.87 28.32,12.63 v28.32,13.65
  Bottom 0.406: v38.73,17.71 38.73,15.17 35.05,11.49 31.37,11.49 29.21,13.65 v28.32,13.65
N$1
  Top 0.406: R5.1 51.55,20.79 51.55,25.4 50.11,26.84 T3.1 48.65,27.6 48.65,29.11 R1.1
N$2
  Top 0.406: R5.2 T1.C
N$6
  Top 0.406: T1.B 43.28,19.3 R7.2 43.13,19.4 41.49,17.76 R6.2 41.49,17.04 40.89,16.44 39.37,16.44 38.86,15.93 38.86,4.92 37.68,3.74 RLED1.1
N$7
  Top 0.406: D1.1 R8.1
N$8
  Top 0.406: R3.2 T2.C
  Top 0.61: T2.C 47.45,11.82 46.99,11.36 43.18,11.36 41.91,10.09 BUZZER.+
N$11
  Top 0.406: OP.2 36.3,23.43 35.94,23.07 R15.1 35.89,20.08 34.15,18.34 R14.2
N$12
  Top 0.406: R11.1 27.09,22.71 28.79,24.41 R10.2 OP.6
N$13
  Top 0.406: RLED1.2 33.44,1.3 LEDR.A
N$15
  Top 0.406: T2.B 41.81,15.49 R9.2
N$47  (via drill 0.35)
  Top 0.254: R21.2 29.46,5.81 v29.46,5.77
  Bottom 0.254: U$2.29 10.16,5.01 12.06,3.11 26.8,3.11 v29.46,5.77
N$52  (via drill 0.35)
  Top 0.254: R19.2 22.01,22.83 v22.61,23.43
  Bottom 0.254: U$2.23 10.16,20.25 14.22,24.31 21.21,24.31 22.1,23.43 v22.61,23.43
N$53  (via drill 0.35)
  Top 0.254: R20.2 22.01,24.61 v21.97,24.57
  Bottom 0.254: U$2.22 10.16,22.79 12.32,24.95 21.59,24.95 v21.97,24.57
N$78
  Top 0.254: STM32F001.4 21.61,6.64 22.1,6.15 24.32,6.15 24.58,5.9 CRYSTAL.1 25,4.33 CL4.2
N$79
  Top 0.254: STM32F001.3 21.11,6.63 20.38,5.9 CRYSTAL.2 19.95,4.33 CL3.2
N$80
  Top 0.254: STM32F001.11 25.11,9.49 25.4,9.2 25.91,9.2 26.16,8.95 26.16,6.91 28.45,4.63 29.34,4.63 29.72,4.25 29.72,1.58 29.34,1.2 LEDG.C
N$81  (via drill 0.35)
  Top 0.406: v20.32,38.03 24.98,38.03 R17.2
  Bottom 0.406: U$2.16 v20.32,38.03
N$83
  Top 0.406: RLED2.2 27.09,1.3 LEDG.A
NRST1  (via drill 0.35)
  Top 0.254: v23.37,9.33 23.11,9.59 STM32F001.7 | U$2.15 10.92,2.47 11.43,2.98 11.43,5.39 13.72,7.68 15.11,7.68 v15.24,7.55
  Bottom 0.254: v23.37,9.33 22.86,9.84 20.83,9.84 18.16,7.17 15.62,7.17 v15.24,7.55
SWCLK1  (via drill 0.35)
  Top 0.254: v13.08,12.5 5.13,12.5 U$2.11 | v19.94,16.57 19.94,17.52 19.54,17.92 STM32F001.37
  Bottom 0.254: v19.94,16.57 19.81,16.69 13.59,16.69 13.21,16.31 13.21,12.63 v13.08,12.5
SWDIO1  (via drill 0.35)
  Top 0.254: v11.81,13.77 11.56,13.77 10.16,15.17 U$2.10 | STM32F001.34 21.11,17.99 v21.08,17.96
  Bottom 0.254: v11.81,13.77 11.81,16.69 13.08,17.96 v21.08,17.96
TEST  (via drill 0.35)
  Top 0.254: v29.08,10.09 29.08,11.74 28.4,12.42 STM32F001.13
  Top 0.406: D1.2 v49.53,23.43
  Bottom 0.254: U$2.28 10.16,7.55 11.05,6.66 11.05,5.14 12.45,3.74 26.42,3.74 29.08,6.41 v29.08,10.09
  Bottom 0.406: v49.53,23.43 49.53,11.36 47.62,9.46 29.72,9.46 v29.08,10.09
VBAT+
  Top 0.254: 29.72,8.31 30.23,7.8 33.91,7.8 34.29,8.19 34.29,9.46 34.8,9.96 37.24,9.96 IC1.9 | STM32F001.17 28.44,14.42 29.72,13.14 29.72,8.31 | R21.1 29.63,8.4 29.72,8.31
VBAT+'
  Top 0.406: IC1.8 36.32,8.82 35.98,8.48 R4.1 R16.2
VBU  (via drill 0.35, 0.4)
  Top 0.254: STM32F001.1 20.11,11.91 20.45,12.25 21.46,12.25 v22.35,13.14 | v13.34,30.41 U$2.4 | v18.67,30.16 18.8,30.16 19.68,29.27 v19.68,22.28
  Bottom 0.254: v22.35,13.14 22.99,13.77 22.99,19.87 22.73,20.12 20.32,20.12 19.68,20.76 v19.68,22.28 | v18.67,30.16 18.41,30.41 v13.34,30.41
VCC  (via drill 0.5)
  Top 0.508: MCP2562.3 14.61,1.85 C9.1 14.72,1.96 17.14,1.96 17.78,2.6 v17.78,7.93 | v16.09,14.6 15.88,14.6 14.47,16.01 14.47,33.47 12.45,35.49 U$2.2
  Bottom 0.508: v17.78,7.93 16,7.93 14.61,9.33 14.61,13.77 15.43,14.6 v16.09,14.6
VCIG
  Top 0.406: OP.5 29.25,25.96 R12.2 27.08,26.38 C2.1
VDD  (via drill 0.35, 0.5, 0.55)
  Top 0.254: STM32F001.36 20.11,20.38 19.74,20.74 C7.1 | STM32F001.9 24.13,11 24.13,10.09 24.51,9.71 24.51,8.93 C12.1 | STM32F001.48 17.82,12.42 17.53,12.12 17.53,10.47 18.27,9.72 C10.1 | STM32F001.24 28.15,17.92 28.43,18.2 C11.1
  Top 0.406: OP.8 31.85,22.16 32.15,21.86 C4.1 32.15,20.36 v31.24,21.27 31.22,21.29 OP.8 | OP.8 32.38,22.16 33.02,22.79 33.02,27.87 32.38,28.51 1C2.8 | 1C2.8 30.48,28.51 29.45,29.54 C1.1 | v36.58,17.2 36.58,16.59 36.73,16.44 IC1.14 | v33.53,30.41 33.53,29.01 33.02,28.51 1C2.8 | v26.16,30.41 26.16,35.02 27.05,35.91 R18.2 | RLED2.1 27.75,4.53 27.74,4.53 25.26,7.01 C12.1
  Top 0.508: v18.41,9.07 C10.1 | C12.1 v24.89,8.19 | v15.62,11.23 v15.63,11.23 C8.1 15.88,10.28 MCP2562.5 | C7.1 19.45,21.27 20.45,21.27 v20.7,21.01 | v29.08,19.49 C11.1
  Top 1.016: 20.7,29.39 v20.7,30.41 v19.68,30.41 20.7,29.39 | 20.7,29.39 v20.7,22.03 v20.7,21.01 | 11.94,32.95 v13.46,32.95 v13.46,31.43 11.94,32.95 | 11.94,32.95 U$2.3
  Bottom 0.813: v31.24,21.27 29.46,19.49 v29.08,19.49 31.11,17.46 31.11,14.34 32.19,13.27 33.91,13.27 36.58,15.93 v36.58,17.2 | v20.7,30.41 v26.16,30.41 v33.53,30.41
  Bottom 1.016: v24.89,8.19 24.89,9.84 24,10.72 23.5,10.72 | 23.5,10.72 20.45,10.72 18.8,9.07 v18.41,9.07 16.26,9.07 15.62,9.71 v15.62,11.23 | 21.59,21.01 27.56,21.01 v29.08,19.49 28.83,19.49 26.29,16.95 26.29,13.52 23.5,10.72 | 21.59,21.01 v20.7,21.01 v20.7,22.03 21.59,21.14 21.59,21.01 | v20.7,30.41 v19.68,30.41 19.68,30.66 18.92,31.43 14.99,31.43 | 14.99,31.43 v13.46,31.43 v13.46,32.95 14.99,31.43
  pour Bottom (rank 2): 27.81,20.38 27.81,17.96 31.37,17.96 31.37,21.27 27.43,21.27 27.43,20.76
VIG
  Top 0.254: IC1.2 29.82,15.17 29.57,15.42 29.21,15.42 | 29.21,15.42 STM32F001.19 | R20.1 24.38,25.33 24.77,24.95 24.77,21.9 25.65,21.01 29.72,21.01 30.61,20.12 30.61,18.73 29.08,17.2 29.08,15.55 29.21,15.42
VIG'
  Top 0.406: OP.1 38.35,22.16 38.61,21.9 38.61,19.49 37.5,18.38 R15.2 34,16.44 IC1.1
VOUT
  Top 0.254: 1C2.7 30.48,29.77 29.84,30.41 28.19,30.41 27.94,30.16 27.94,28.84 28.69,28.09 R12.1
  Top 0.406: R12.1 29.2,28.09 | 30.89,29.77 1C2.7
VVIG
  Top 0.406: OP.3 38.57,24.7 39.79,23.48 R13.2 39.79,21.55 C3.1 39.79,21.5 D2.C

### Text on the board
Top: WASA Rocket Project
tNames: Igniter Driver Module
tStop: WASA Rocket Project
bStop: Designed by @fujiy0, 2019